# Altium schematic sheet Output_block.SchDoc
size A3
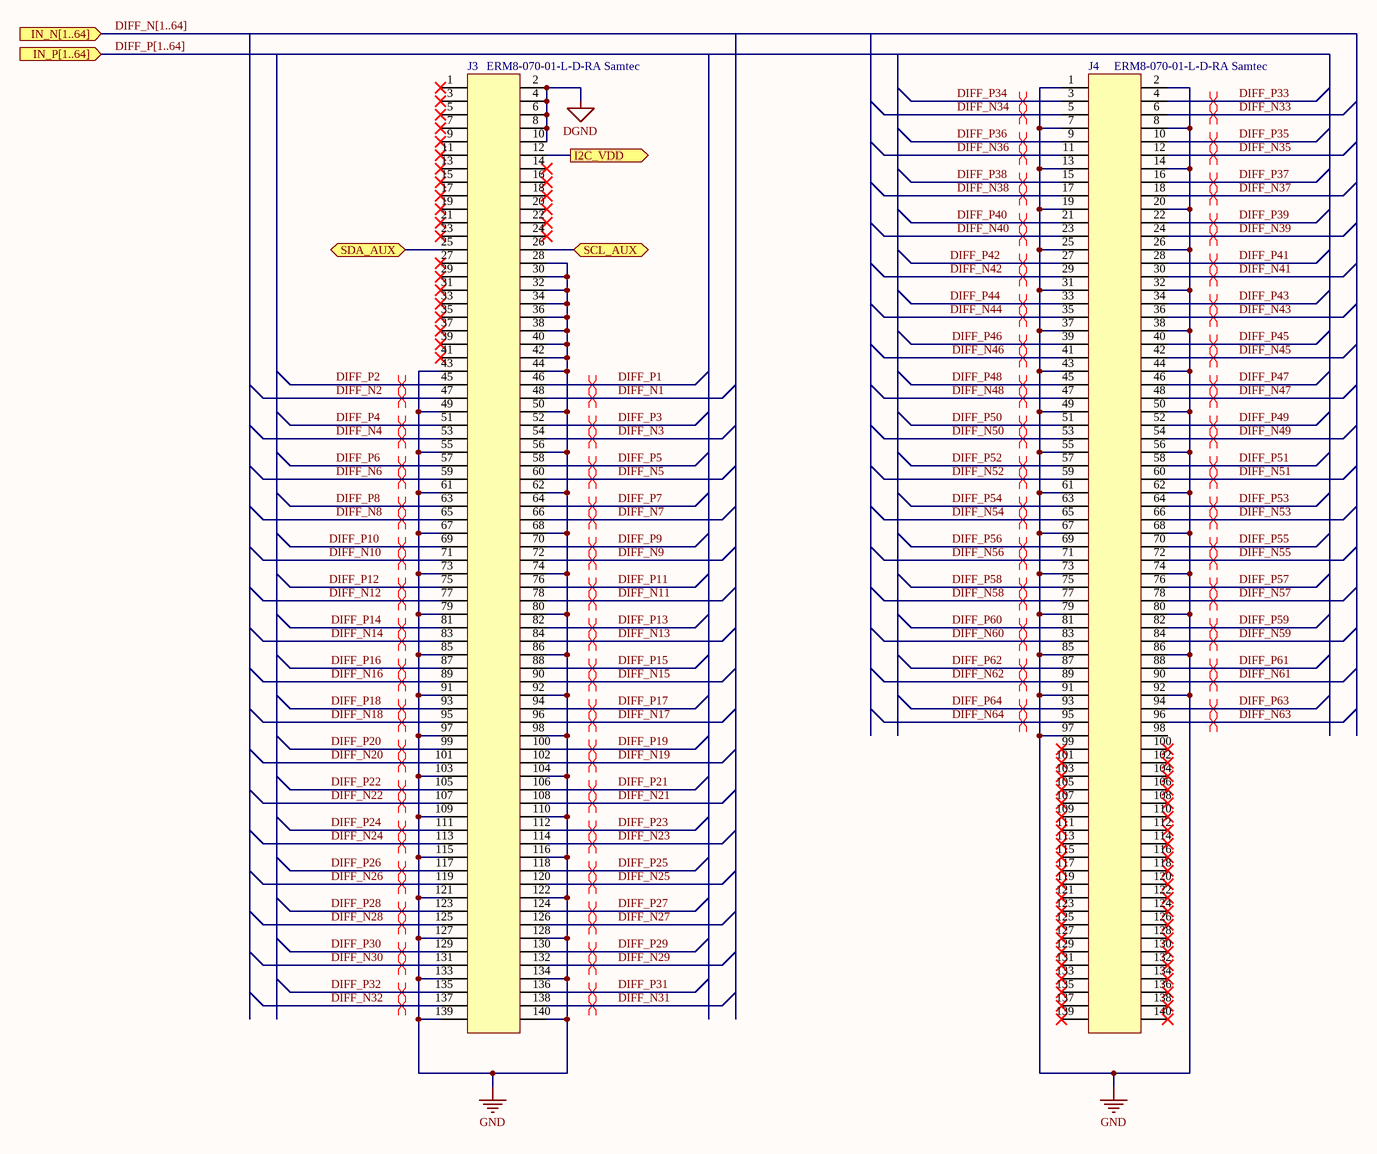
[diagram p0: Output_block.SchDoc]

## Parts
J3  ERM8-070-01-L-D-RA Samtec  [ERM8-070-01-L-D-RA]
J4  ERM8-070-01-L-D-RA Samtec  [ERM8-070-01-L-D-RA]

## Ports
I2C_VDD (out), IN_N[1..64] (in), IN_P[1..64] (in), SCL_AUX (bidir), SDA_AUX (bidir)

## Nets
DGND: J3.2 J3.4 J3.6 J3.8 J3.10
GND: J3.28 J3.30 J3.32 J3.34 J3.36 J3.38 J3.40 J3.42 J3.43 J3.44 J3.49 J3.50 J3.55 J3.56 J3.61 J3.62 J3.67 J3.68 J3.73 J3.74 J3.79 J3.80 J3.85 J3.86 J3.91 J3.92 J3.97 J3.98 J3.103 J3.104 J3.109 J3.110 J3.115 J3.116 J3.121 J3.122 J3.127 J3.128 J3.133 J3.134 J3.139 J3.140 J4.1 J4.2 J4.7 J4.8 J4.13 J4.14 J4.19 J4.20 J4.25 J4.26 J4.31 J4.32 J4.37 J4.38 J4.43 J4.44 J4.49 J4.50 J4.55 J4.56 J4.61 J4.62 J4.67 J4.68 J4.73 J4.74 J4.79 J4.80 J4.85 J4.86 J4.91 J4.92 J4.97
DIFF_N1: J3.48
DIFF_N2: J3.47
DIFF_N3: J3.54
DIFF_N4: J3.53
DIFF_N5: J3.60
DIFF_N6: J3.59
DIFF_N7: J3.66
DIFF_N8: J3.65
DIFF_N9: J3.72
DIFF_N10: J3.71
DIFF_N11: J3.78
DIFF_N12: J3.77
DIFF_N13: J3.84
DIFF_N14: J3.83
DIFF_N15: J3.90
DIFF_N16: J3.89
DIFF_N17: J3.96
DIFF_N18: J3.95
DIFF_N19: J3.102
DIFF_N20: J3.101
DIFF_N21: J3.108
DIFF_N22: J3.107
DIFF_N23: J3.114
DIFF_N24: J3.113
DIFF_N25: J3.120
DIFF_N26: J3.119
DIFF_N27: J3.126
DIFF_N28: J3.125
DIFF_N29: J3.132
DIFF_N30: J3.131
DIFF_N31: J3.138
DIFF_N32: J3.137
DIFF_N33: J4.6
DIFF_N34: J4.5
DIFF_N35: J4.12
DIFF_N36: J4.11
DIFF_N37: J4.18
DIFF_N38: J4.17
DIFF_N39: J4.24
DIFF_N40: J4.23
DIFF_N41: J4.30
DIFF_N42: J4.29
DIFF_N43: J4.36
DIFF_N44: J4.35
DIFF_N45: J4.42
DIFF_N46: J4.41
DIFF_N47: J4.48
DIFF_N48: J4.47
DIFF_N49: J4.54
DIFF_N50: J4.53
DIFF_N51: J4.60
DIFF_N52: J4.59
DIFF_N53: J4.66
DIFF_N54: J4.65
DIFF_N55: J4.72
DIFF_N56: J4.71
DIFF_N57: J4.78
DIFF_N58: J4.77
DIFF_N59: J4.84
DIFF_N60: J4.83
DIFF_N61: J4.90
DIFF_N62: J4.89
DIFF_N63: J4.96
DIFF_N64: J4.95
DIFF_P1: J3.46
DIFF_P2: J3.45
DIFF_P3: J3.52
DIFF_P4: J3.51
DIFF_P5: J3.58
DIFF_P6: J3.57
DIFF_P7: J3.64
DIFF_P8: J3.63
DIFF_P9: J3.70
DIFF_P10: J3.69
DIFF_P11: J3.76
DIFF_P12: J3.75
DIFF_P13: J3.82
DIFF_P14: J3.81
DIFF_P15: J3.88
DIFF_P16: J3.87
DIFF_P17: J3.94
DIFF_P18: J3.93
DIFF_P19: J3.100
DIFF_P20: J3.99
DIFF_P21: J3.106
DIFF_P22: J3.105
DIFF_P23: J3.112
DIFF_P24: J3.111
DIFF_P25: J3.118
DIFF_P26: J3.117
DIFF_P27: J3.124
DIFF_P28: J3.123
DIFF_P29: J3.130
DIFF_P30: J3.129
DIFF_P31: J3.136
DIFF_P32: J3.135
DIFF_P33: J4.4
DIFF_P34: J4.3
DIFF_P35: J4.10
DIFF_P36: J4.9
DIFF_P37: J4.16
DIFF_P38: J4.15
DIFF_P39: J4.22
DIFF_P40: J4.21
DIFF_P41: J4.28
DIFF_P42: J4.27
DIFF_P43: J4.34
DIFF_P44: J4.33
DIFF_P45: J4.40
DIFF_P46: J4.39
DIFF_P47: J4.46
DIFF_P48: J4.45
DIFF_P49: J4.52
DIFF_P50: J4.51
DIFF_P51: J4.58
DIFF_P52: J4.57
DIFF_P53: J4.64
DIFF_P54: J4.63
DIFF_P55: J4.70
DIFF_P56: J4.69
DIFF_P57: J4.76
DIFF_P58: J4.75
DIFF_P59: J4.82
DIFF_P60: J4.81
DIFF_P61: J4.88
DIFF_P62: J4.87
DIFF_P63: J4.94
DIFF_P64: J4.93
I2C_VDD: J3.12 ; port I2C_VDD
SCL_AUX: J3.26 ; port SCL_AUX
SDA_AUX: J3.25 ; port SDA_AUX

Not connected (* = marked no-connect by the designer): J3 1* 3* 5* 7* 9* 11* 13* 14* 15* 16* 17* 18* 19* 20* 21* 22* 23* 24* 27* 29* 31* 33* 35* 37* 39* 41*; J4 98 99* 100* 101* 102* 103* 104* 105* 106* 107* 108* 109* 110* 111* 112* 113* 114* 115* 116* 117* 118* 119* 120* 121* 122* 123* 124* 125* 126* 127* 128* 129* 130* 131* 132* 133* 134* 135* 136* 137* 138* 139* 140*

## Buses and harness runs
bus DIFF_N[1..64] = port IN_N[1..64]
bus DIFF_P[1..64] = port IN_P[1..64]

## Layout directives
differential pair: DIFF_N1, DIFF_N2, DIFF_N3, DIFF_N4, DIFF_N5, DIFF_N6, DIFF_N7, DIFF_N8, DIFF_N9, DIFF_N10, DIFF_N11, DIFF_N12, DIFF_N13, DIFF_N14, DIFF_N15, DIFF_N16, DIFF_N17, DIFF_N18, DIFF_N19, DIFF_N20, DIFF_N21, DIFF_N22, DIFF_N23, DIFF_N24, DIFF_N25, DIFF_N26, DIFF_N27, DIFF_N28, DIFF_N29, DIFF_N30, DIFF_N31, DIFF_N32, DIFF_N33, DIFF_N34, DIFF_N35, DIFF_N36, DIFF_N37, DIFF_N38, DIFF_N39, DIFF_N40, DIFF_N41, DIFF_N42, DIFF_N43, DIFF_N44, DIFF_N45, DIFF_N46, DIFF_N47, DIFF_N48, DIFF_N49, DIFF_N50, DIFF_N51, DIFF_N52, DIFF_N53, DIFF_N54, DIFF_N55, DIFF_N56, DIFF_N57, DIFF_N58, DIFF_N59, DIFF_N60, DIFF_N61, DIFF_N62, DIFF_N63, DIFF_N64, DIFF_P1, DIFF_P2, DIFF_P3, DIFF_P4, DIFF_P5, DIFF_P6, DIFF_P7, DIFF_P8, DIFF_P9, DIFF_P10, DIFF_P11, DIFF_P12, DIFF_P13, DIFF_P14, DIFF_P15, DIFF_P16, DIFF_P17, DIFF_P18, DIFF_P19, DIFF_P20, DIFF_P21, DIFF_P22, DIFF_P23, DIFF_P24, DIFF_P25, DIFF_P26, DIFF_P27, DIFF_P28, DIFF_P29, DIFF_P30, DIFF_P31, DIFF_P32, DIFF_P33, DIFF_P34, DIFF_P35, DIFF_P36, DIFF_P37, DIFF_P38, DIFF_P39, DIFF_P40, DIFF_P41, DIFF_P42, DIFF_P43, DIFF_P44, DIFF_P45, DIFF_P46, DIFF_P47, DIFF_P48, DIFF_P49, DIFF_P50, DIFF_P51, DIFF_P52, DIFF_P53, DIFF_P54, DIFF_P55, DIFF_P56, DIFF_P57, DIFF_P58, DIFF_P59, DIFF_P60, DIFF_P61, DIFF_P62, DIFF_P63, DIFF_P64

## Library data of the parts
J3 J4 = ERM8-070-01-L-D-RA: Name: ERM8-070-01-L-D-RA; Manufacturer: Samtec